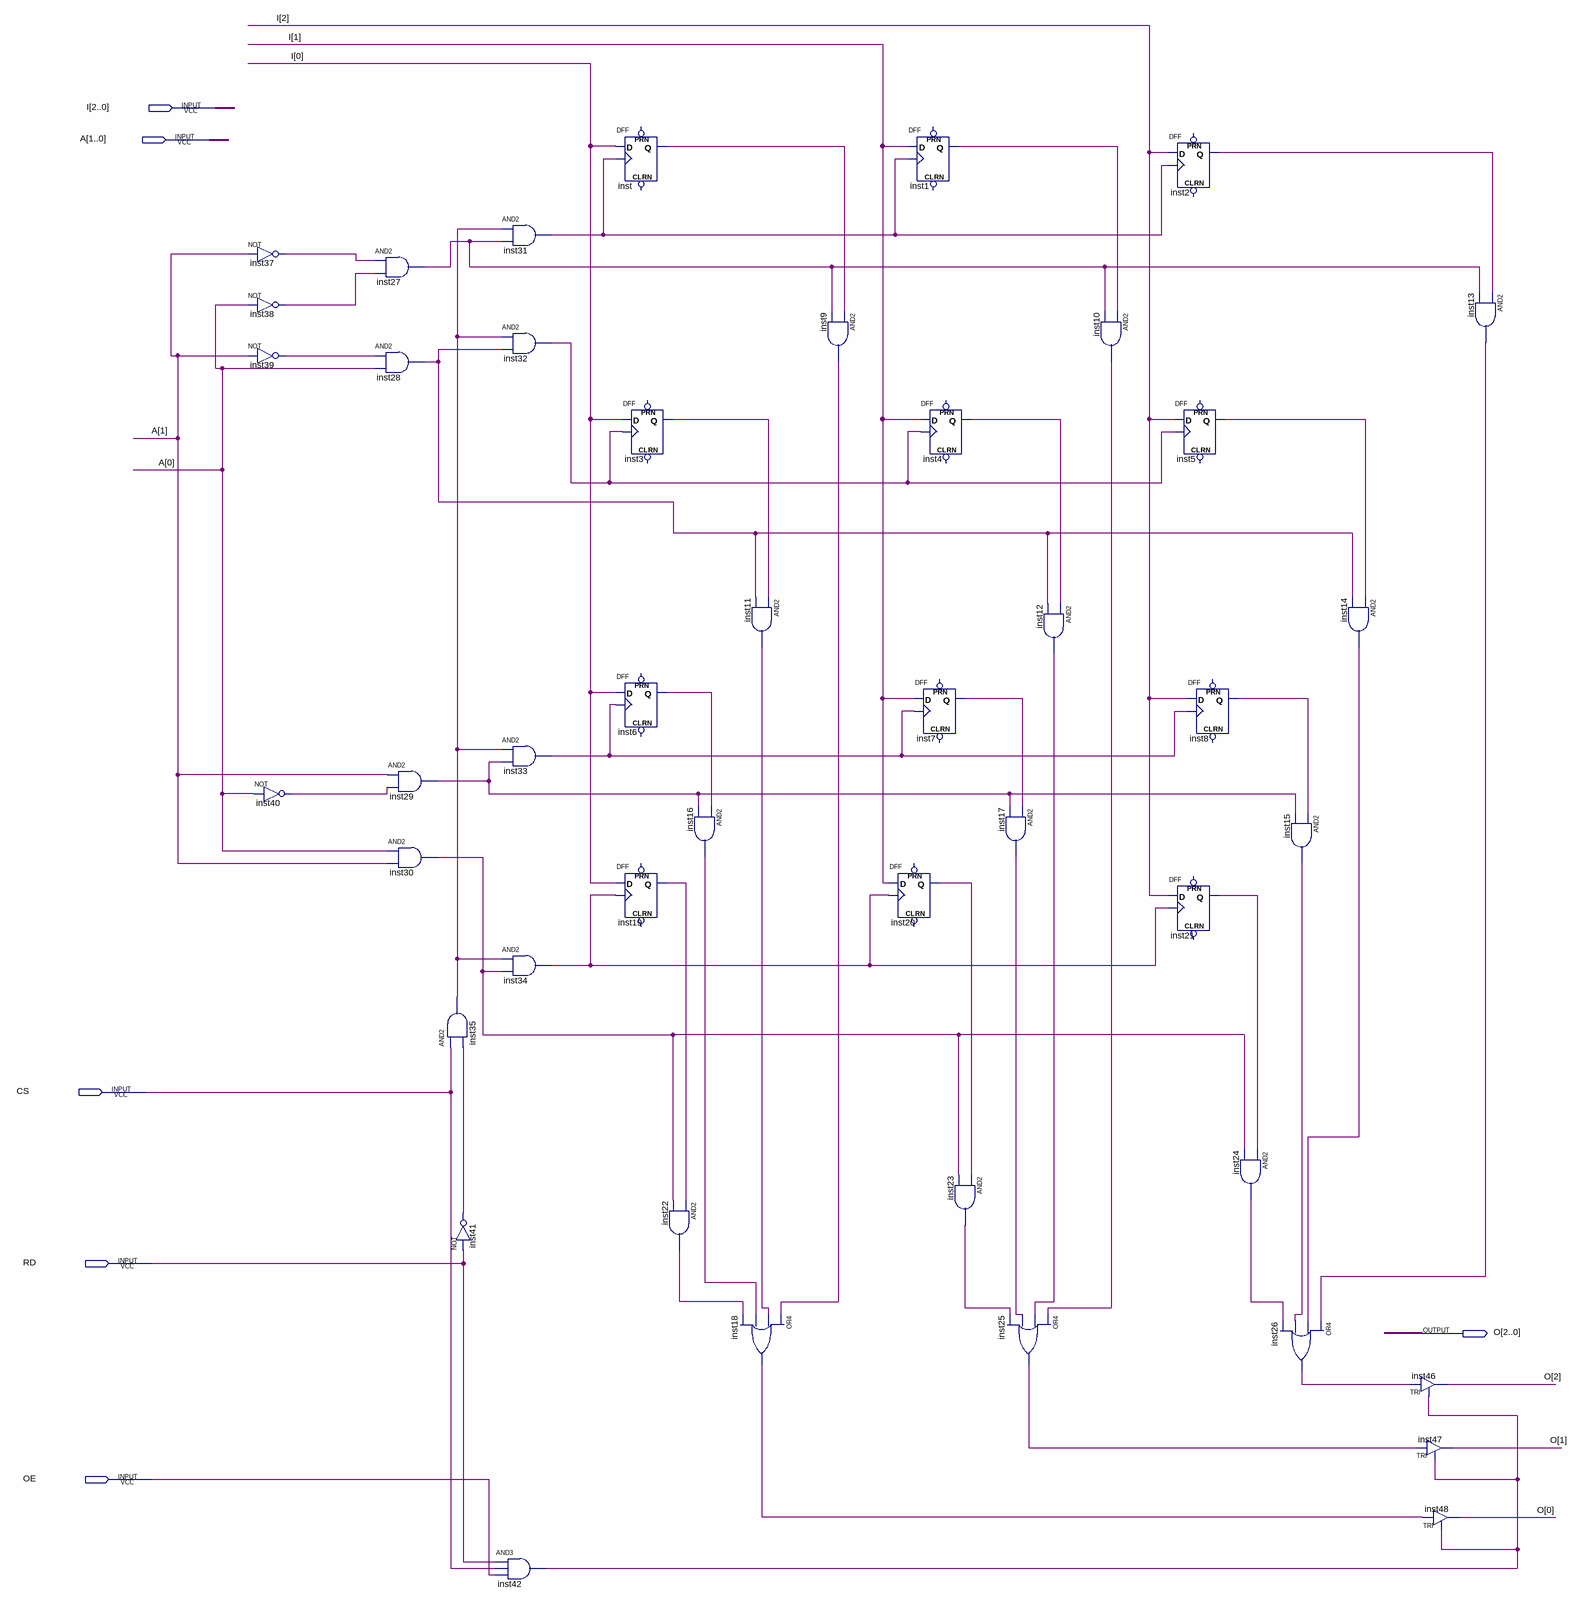
[diagram p0: schematic sheet]
// Quartus schematic mem_4x3.bdf as structural Verilog: 45 symbols, 6 pins
module mem_4x3 (
  input  [2:0] I,
  input  [1:0] A,
  input  CS,
  input  RD,
  input  OE,
  output [2:0] O
);

  wire inst1_q, inst2_q, inst3_q, inst4_q, inst5_q, inst6_q, inst7_q, inst8_q, inst9_out, inst10_out,
       inst11_out, inst12_out, inst13_out, inst14_out, inst15_out, inst16_out, inst17_out, inst18_out,
       inst19_q, inst20_q, inst21_q, inst22_out, inst23_out, inst24_out, inst25_out, inst26_out, inst27_out,
       inst28_out, inst29_out, inst30_out, inst31_out, inst32_out, inst33_out, inst34_out, inst35_out,
       inst37_out, inst38_out, inst39_out, inst40_out, inst41_out, inst42_out, inst_q;

  not inst37 (inst37_out, A[1]);
  not inst38 (inst38_out, A[0]);
  not inst39 (inst39_out, A[1]);
  not inst40 (inst40_out, A[0]);
  and inst27 (inst27_out, inst37_out, inst38_out);
  and inst28 (inst28_out, inst39_out, A[0]);
  and inst29 (inst29_out, A[1], inst40_out);
  and inst30 (inst30_out, A[0], A[1]);
  and inst35 (inst35_out, CS, inst41_out);
  not inst41 (inst41_out, RD);
  and inst31 (inst31_out, inst35_out, inst27_out);
  and inst32 (inst32_out, inst35_out, inst28_out);
  and inst33 (inst33_out, inst35_out, inst29_out);
  and inst34 (inst34_out, inst35_out, inst30_out);
  and inst42 (inst42_out, RD, CS, OE);
  DFF inst (.CLK(inst31_out), .D(I[0]), .Q(inst_q));  // open: CLRN, PRN
  DFF inst3 (.CLK(inst32_out), .D(I[0]), .Q(inst3_q));  // open: CLRN, PRN
  DFF inst6 (.CLK(inst33_out), .D(I[0]), .Q(inst6_q));  // open: CLRN, PRN
  DFF inst19 (.CLK(inst34_out), .D(I[0]), .Q(inst19_q));  // open: CLRN, PRN
  and inst16 (inst16_out, inst6_q, inst29_out);
  and inst22 (inst22_out, inst19_q, inst30_out);
  and inst11 (inst11_out, inst3_q, inst28_out);
  or inst18 (inst18_out, inst9_out, inst11_out, inst16_out, inst22_out);
  and inst9 (inst9_out, inst_q, inst27_out);
  DFF inst1 (.CLK(inst31_out), .D(I[1]), .Q(inst1_q));  // open: CLRN, PRN
  DFF inst20 (.CLK(inst34_out), .D(I[1]), .Q(inst20_q));  // open: CLRN, PRN
  DFF inst4 (.CLK(inst32_out), .D(I[1]), .Q(inst4_q));  // open: CLRN, PRN
  DFF inst7 (.CLK(inst33_out), .D(I[1]), .Q(inst7_q));  // open: CLRN, PRN
  and inst23 (inst23_out, inst20_q, inst30_out);
  and inst17 (inst17_out, inst7_q, inst29_out);
  or inst25 (inst25_out, inst10_out, inst12_out, inst17_out, inst23_out);
  and inst12 (inst12_out, inst4_q, inst28_out);
  and inst10 (inst10_out, inst1_q, inst27_out);
  DFF inst2 (.CLK(inst31_out), .D(I[2]), .Q(inst2_q));  // open: CLRN, PRN
  DFF inst5 (.CLK(inst32_out), .D(I[2]), .Q(inst5_q));  // open: CLRN, PRN
  DFF inst8 (.CLK(inst33_out), .D(I[2]), .Q(inst8_q));  // open: CLRN, PRN
  DFF inst21 (.CLK(inst34_out), .D(I[2]), .Q(inst21_q));  // open: CLRN, PRN
  and inst24 (inst24_out, inst21_q, inst30_out);
  and inst15 (inst15_out, inst8_q, inst29_out);
  or inst26 (inst26_out, inst13_out, inst14_out, inst15_out, inst24_out);
  and inst14 (inst14_out, inst5_q, inst28_out);
  TRI inst46 (.IN(inst26_out), .OE(inst42_out), .OUT(O[2]));
  TRI inst47 (.IN(inst25_out), .OE(inst42_out), .OUT(O[1]));
  and inst13 (inst13_out, inst2_q, inst27_out);
  TRI inst48 (.IN(inst18_out), .OE(inst42_out), .OUT(O[0]));
endmodule
